# EAGLE schematic TLCduino (EAGLE 6.1)
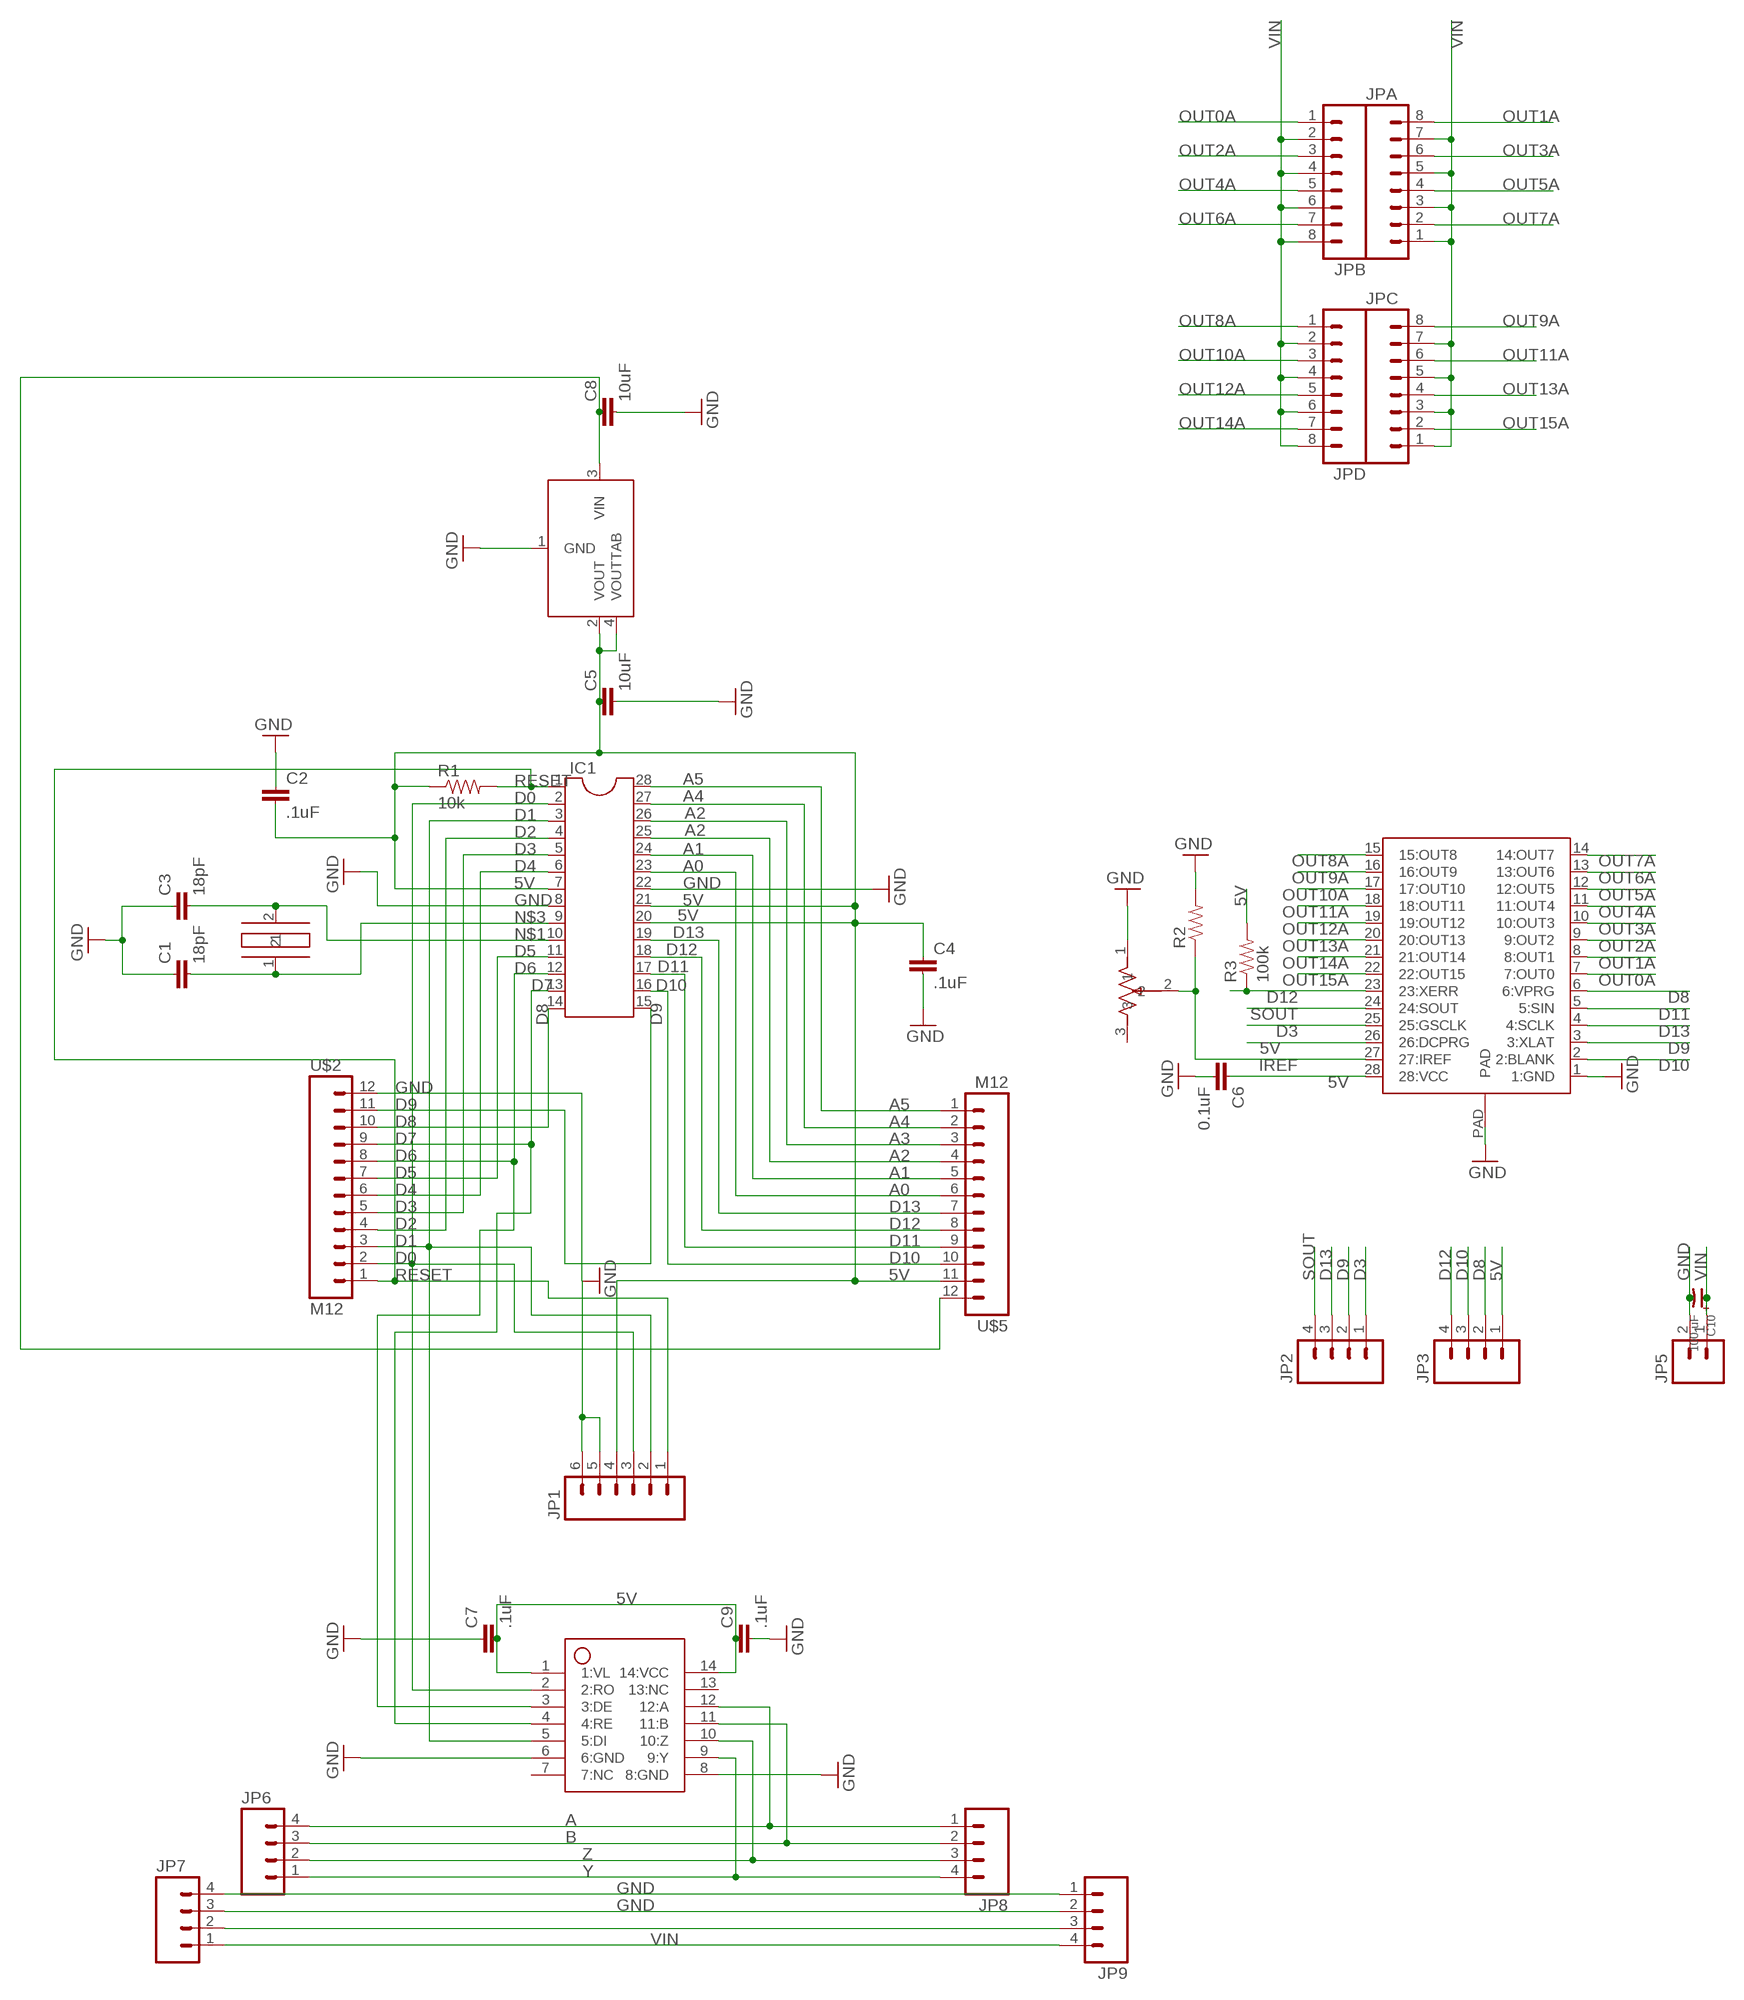
[diagram p0: schematic, sheet 1]

## Parts
5V  ZLDO1117  [ZLDO1117]
C1  18pF  CAP0603-CAP  [0603-CAP]
C2  .1uF  CAP0805  [0805]
C3  18pF  CAP0603-CAP  [0603-CAP]
C4  .1uF  CAP0805  [0805]
C5  10uF  CAP1206  [1206]
C6  0.1uF  CAP0805  [0805]
C7  .1uF  CAP0805  [0805]
C8  10uF  CAP1206  [1206]
C9  .1uF  CAP0805  [0805]
C10  100 uF  CAPPOL-5X11  [5X11MMCAP]
IC1  DIL28-3  [DIL28-3]
JP1  M06LOCK  [1X06_LOCK]
JP2  M04LOCK  [1X04_LOCK]
JP3  M04LOCK  [1X04_LOCK]
JP5  M02LOCK  [1X02_LOCK]
JP6  M04LOCK  [1X04_LOCK]
JP7  M04LOCK  [1X04_LOCK]
JP8  M04LOCK  [1X04_LOCK]
JP9  M04LOCK  [1X04_LOCK]
JPA  M08LOCK  [1X08_LOCK]
JPB  M08LOCK  [1X08_LOCK]
JPC  M08LOCK  [1X08_LOCK]
JPD  M08LOCK  [1X08_LOCK]
R1  10k  RESISTOR  [0805]
R2  RESISTOR  [0805]
R3  100k  RESISTOR  [0805]
U$1  HC49US  [HC49US]
U$2  M12  M12LOCK  [1X12_LOCK]
U$3  TLC5940  [HTSSOP-28]
U$4  TRIMPOTTC33X-2  [TC33X-2]
U$5  M12  M12LOCK  [1X12_LOCK]
U$6  MAX13432  [SO14]

## Nets
5V: 5V.2(VOUT) 5V.4(VOUTTAB) C2.2 C4.1 C5.1 C6.1 C7.2 C9.1 IC1.7 IC1.20 IC1.21 JP1.4 JP3.1 R1.1 R3.2 U$3.26(26:DCPRG) U$3.28(28:VCC) U$5.11 U$6.1(1:VL) U$6.14(14:VCC)
A: JP6.4 JP8.1 U$6.12(12:A)
A0: IC1.23 U$5.6
A1: IC1.24 U$5.5
A2: IC1.25 U$5.4
A3: IC1.26 U$5.3
A4: IC1.27 U$5.2
A5: IC1.28 U$5.1
B: JP6.3 JP8.2 U$6.11(11:B)
D0: IC1.2 JP1.3 U$2.2 U$6.2(2:RO)
D1: IC1.3 JP1.2 U$2.3 U$6.5(5:DI)
D2: IC1.4 U$2.4
D3: IC1.5 JP2.1 U$2.5 U$3.25(25:GSCLK)
D4: IC1.6 U$2.6
D5: IC1.11 U$2.7
D6: IC1.12 U$2.8 U$6.3(3:DE)
D7: IC1.13 U$2.9 U$6.4(4:RE)
D8: IC1.14 JP3.2 U$2.10 U$3.6(6:VPRG)
D9: IC1.15 JP2.2 U$2.11 U$3.3(3:XLAT)
D10: IC1.16 JP3.3 U$3.2(2:BLANK) U$5.10
D11: IC1.17 U$3.5(5:SIN) U$5.9
D12: IC1.18 JP3.4 R3.1 U$3.23(23:XERR) U$5.8
D13: IC1.19 JP2.3 U$3.4(4:SCLK) U$5.7
GND: 5V.1(GND) C1.1 C2.1 C3.1 C4.2 C5.2 C6.2 C7.1 C8.2 C9.2 C10.- IC1.8 IC1.22 JP1.5 JP1.6 JP5.2 JP7.3 JP7.4 JP9.1 JP9.2 R2.2 U$2.12 U$3.1(1:GND) U$3.PAD U$4.1 U$6.6(6:GND) U$6.8(8:GND)
IREF: R2.1 U$3.27(27:IREF) U$4.2
N$1: C3.2 IC1.10 U$1.2
N$3: C1.2 IC1.9 U$1.1
OUT0A: JPB.1 U$3.7(7:OUT0)
OUT1A: JPA.8 U$3.8(8:OUT1)
OUT2A: JPB.3 U$3.9(9:OUT2)
OUT3A: JPA.6 U$3.10(10:OUT3)
OUT4A: JPB.5 U$3.11(11:OUT4)
OUT5A: JPA.4 U$3.12(12:OUT5)
OUT6A: JPB.7 U$3.13(13:OUT6)
OUT7A: JPA.2 U$3.14(14:OUT7)
OUT8A: JPD.1 U$3.15(15:OUT8)
OUT9A: JPC.8 U$3.16(16:OUT9)
OUT10A: JPD.3 U$3.17(17:OUT10)
OUT11A: JPC.6 U$3.18(18:OUT11)
OUT12A: JPD.5 U$3.19(19:OUT12)
OUT13A: JPC.4 U$3.20(20:OUT13)
OUT14A: JPD.7 U$3.21(21:OUT14)
OUT15A: JPC.2 U$3.22(22:OUT15)
RESET: IC1.1 JP1.1 R1.2 U$2.1
SOUT: JP2.4 U$3.24(24:SOUT)
VIN: 5V.3(VIN) C8.1 C10.+ JP5.1 JP7.1 JP7.2 JP9.3 JP9.4 JPA.1 JPA.3 JPA.5 JPA.7 JPB.2 JPB.4 JPB.6 JPB.8 JPC.1 JPC.3 JPC.5 JPC.7 JPD.2 JPD.4 JPD.6 JPD.8 U$5.12
Y: JP6.1 JP8.4 U$6.9(9:Y)
Z: JP6.2 JP8.3 U$6.10(10:Z)
Unconnected: U$4.3 U$6.7(7:NC) U$6.13(13:NC)

## Library data of the parts
5V = 1dah:ZLDO1117
C1-C9 = 1dah:CAP: Capacitor Standard 0402 ceramic capacitor, and 0.1" leaded capacitor.
C10 = 1dah:CAPPOL
IC1 = 1dah:DIL28: Dual In Line
JP1 = 1dah:M06: Header 6 Standard 6-pin 0.1" header. Use with straight break away headers (SKU : PRT-00116), right angle break away headers (PRT-00553), swiss pins (PRT-00743), machine pins (PRT-00117), and female headers (PRT-00115). Molex polarized connector foot print use with SKU : PRT-08094 with associated crimp pins and housings. NOTES ON THE VARIANTS LOCK and LOCK_LONGPADS... This footprint was designed to help hold the alignment of a through-hole component (i.e. 6-pin header) while soldering it into place. You may notice that each hole has been shifted either up or down by 0.005 of an inch from it's more standard position (which is a perfectly straight line). This slight alteration caused the pins (the squares in the middle) to touch the edges of the holes. Because they are alternating, it causes a "brace" to hold the component in place. 0.005 has proven to be the perfect amount of "off-center" position when using our standard breakaway headers. Although looks a little odd when you look at the bare footprint, once you have a header in there, the alteration is very hard to notice. Also, if you push a header all the way into place, it is covered up entirely on the bottom side. This idea of altering the position of holes to aid alignment will be further integrated into the Sparkfun Library for other footprints. It can help hold any component with 3 or more connection pins.
JP2 JP3 JP6-JP9 = 1dah:M04: Header 4 Standard 4-pin 0.1" header. Use with straight break away headers (SKU : PRT-00116), right angle break away headers (PRT-00553), swiss pins (PRT-00743), machine pins (PRT-00117), and female headers (PRT-00115). Molex polarized connector foot print use with SKU : PRT-08231 with associated crimp pins and housings.
JP5 = 1dah:M02: Header 2 Standard 2-pin 0.1" header. Use with straight break away headers (SKU : PRT-00116), right angle break away headers (PRT-00553), swiss pins (PRT-00743), machine pins (PRT-00117), and female headers (PRT-00115). Molex polarized connector foot print use with SKU : PRT-08233 with associated crimp pins and housings.
JPA JPB JPC JPD = 1dah:M08: Header 8 Standard 8-pin 0.1" header. Use with straight break away headers (SKU : PRT-00116), right angle break away headers (PRT-00553), swiss pins (PRT-00743), machine pins (PRT-00117), and female headers (PRT-00115).
R1-R3 = 1dah:RESISTOR: Resistor Basic schematic elements and footprints for 0603, 1206, and PTH 1/10th watt (small) resistors.
U$1 = 1dah:HC49US: 16 MHz crystal
U$2 U$5 = 1dah:M12: Header 12 Standard 12-pin 0.1" header. Use with straight break away headers (SKU : PRT-00116), right angle break away headers (PRT-00553), swiss pins (PRT-00743), machine pins (PRT-00117), and female headers (PRT-00115).
U$3 = 1dah:TLC5940
U$4 = 1dah:TRIMPOT: Bournes Trimpot
U$6 = 1dah:MAX13432: Full duplex RS285 interface